# Altium schematic sheet 3V_ADC_SUPPLY.SchDoc: My title
size A3; Organization: University of California; Address1: 475 Portola Plaza; Address2: Los Angeles, CA 90095; DocumentNumber: 9; Revision: R01; SheetNumber: 9; SheetTotal: 35
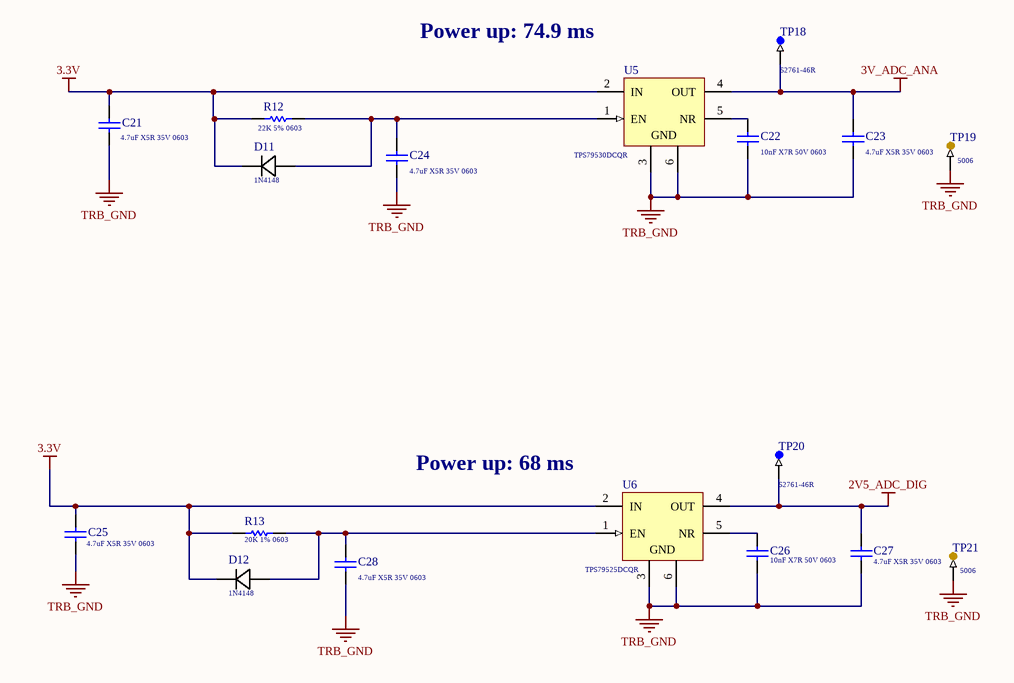
[diagram p0: 3V_ADC_SUPPLY.SchDoc]

## Parts
C21  Capacitance: 4.7uF X5R 35V 0603  [Cap_Murata_ZRB18AR6YA475ME05L_4.7uF]  (hidden comment: Cap_Murata_ZRB18AR6YA475ME05L_4.7uF)
C22  Capacitance: 10nF X7R 50V 0603  [Kemet_C0603_0]  (hidden comment: Cap_Kemet_C0603C103J5RACTU_eec)
C23  Capacitance: 4.7uF X5R 35V 0603  [Cap_Murata_ZRB18AR6YA475ME05L_4.7uF]  (hidden comment: Cap_Murata_ZRB18AR6YA475ME05L_4.7uF)
C24  Capacitance: 4.7uF X5R 35V 0603  [Cap_Murata_ZRB18AR6YA475ME05L_4.7uF]  (hidden comment: Cap_Murata_ZRB18AR6YA475ME05L_4.7uF)
C25  Capacitance: 4.7uF X5R 35V 0603  [Cap_Murata_ZRB18AR6YA475ME05L_4.7uF]  (hidden comment: Cap_Murata_ZRB18AR6YA475ME05L_4.7uF)
C26  Capacitance: 10nF X7R 50V 0603  [Kemet_C0603_0]  (hidden comment: Cap_Kemet_C0603C103J5RACTU_eec)
C27  Capacitance: 4.7uF X5R 35V 0603  [Cap_Murata_ZRB18AR6YA475ME05L_4.7uF]  (hidden comment: Cap_Murata_ZRB18AR6YA475ME05L_4.7uF)
C28  Capacitance: 4.7uF X5R 35V 0603  [Cap_Murata_ZRB18AR6YA475ME05L_4.7uF]  (hidden comment: Cap_Murata_ZRB18AR6YA475ME05L_4.7uF)
D11  Series: 1N4148  [Diode_ON_Semiconductor_1N4148WT_300mA]  (hidden comment: Diode_ON_Semiconductor_1N4148WT_300mA)
D12  Series: 1N4148  [Diode_ON_Semiconductor_1N4148WT_300mA]  (hidden comment: Diode_ON_Semiconductor_1N4148WT_300mA)
R12  22K 5% 0603  [RESC0603(1608)_L]
R13  20K 1% 0603  [RESC0603(1608)_L]
TP18  Series: S2761-46R  [TP_Harwin_S2761_46R]  (hidden comment: TP_Harwin_S2761_46R)
TP19  Series: 5006  [TP_Keystone_Electronics_5006]  (hidden comment: TP_Keystone_Electronics_5006)
TP20  Series: S2761-46R  [TP_Harwin_S2761_46R]  (hidden comment: TP_Harwin_S2761_46R)
TP21  Series: 5006  [TP_Keystone_Electronics_5006]  (hidden comment: TP_Keystone_Electronics_5006)
U5  TPS79530DCQR  [TI-DCQ6_N]
U6  TPS79525DCQR  [DCQ0006A_N]

## Nets
2V5_ADC_DIG: C27.2 TP20.1 U6.4(OUT)
3.3V: C21.2 C25.2 D11.1 D12.1 R12.1 R13.2 U5.2(IN) U6.2(IN)
3V_ADC_ANA: C23.2 TP18.1 U5.4(OUT)
TRB_GND: C21.1 C22.2 C23.1 C24.1 C25.1 C26.2 C27.1 C28.1 TP19.1 TP21.1 U5.3(GND) U5.6(GND) U6.3(GND) U6.6(GND)
NetC22_1: C22.1 U5.5(NR)
NetC24_2: C24.2 D11.2 R12.2 U5.1(EN)
NetC26_1: C26.1 U6.5(NR)
NetC28_2: C28.2 D12.2 R13.1 U6.1(EN)

## Notes on the sheet
- (near U5) Power up: 74.9 ms
- (near U6) Power up: 68 ms
- 475 Portola Plaza
- GAPS TOF
- igarcia91@g.ucla.edu
- Los Angeles, CA
- 310-825-0344
- Size:
- Date:
- Letter
- Revision:
- Time:
- Sheet
- of
- andrew.peck@cern.ch
- spq@ucla.edu
- File:

## Library data of the parts
C21 C23-C25 C27 C28 = Cap_Murata_ZRB18AR6YA475ME05L_4.7uF: CAP CER 4.7uF 35V X5R 0603; Supplier 1: Mouser; Supplier Part Number 1: 81-ZRB18AR6YA475ME5L
C22 C26 = Cap_Kemet_C0603C103J5RACTU_eec: CAP CER 10nF 50V X7R 0603; Manufacturer: Kemet; Mfg Package Ident: C0603; Part Number: C0603C103J5RACTU; helpURL: https://upverter.com/upn/revision/8a8d0c297e33ac74/; ComponentLink2Description: Datasheet; Temperature: -55°C to +125°C; Package: C0603; Supplier 2: Mouser; Price: 0.0184203126773; Supplier 1: Digi-Key; ComponentLink1URL: https://upverter.com/upn/revision/8a8d0c297e33ac74/; Supplier Part Number 2: 80-C0603C103J5R; Supplier Part Number 1: 399-1092-1-ND; Value: 10nF; ComponentLink1Description: Upverter; ComponentLink2URL: https://content.kemet.com/datasheets/KEM_C1002_X7R_SMD.pdf; RoHS: TRUE; Mouser Part Number: 80-C0603C103J5R; Temperature Range High: +125°C; Digikey Description: CAP CER 10000PF 50V X7R 0603; Digikey Part Number: 399-1092-1-ND; Lead Free: yes; Temperature Range Low: -55°C; Voltage: 50V
D11 D12 = Diode_ON_Semiconductor_1N4148WT_300mA: Diodes - General Purpose, Power, Switching SINGLE JUNC. 75V 4.0NS COMP; Supplier 1: Mouser; Supplier Part Number 1: 512-1N4148WT
R12 = CMP-1012-00106-1: 22K 0.1W 5% 0603 (1608 Metric)  SMD; Case-Metric: 1608; Value: 22000.00 Ohm; Case-EIA: 0603; Power: 0.1 W; Tolerance: 5 %; Technology: SMT
R13 = CMP-1012-00655-1: 20K 0.1W 1% 0603 (1608 Metric)  SMD; Case-Metric: 1608; Case-EIA: 0603; Value: 20000.00 Ohm; Technology: SMT; Tolerance: 1 %; Power: 0.1 W
TP18 TP20 = TP_Harwin_S2761_46R: Circuit Board Hardware - PCB SMT Mini Test Terminal, Reel; Supplier 1: Newark; Supplier Part Number 1: 76Y5391
TP19 TP21 = TP_Keystone_Electronics_5006: Circuit Board Hardware - PCB TEST POINT BLK .063; Supplier 1: Mouser; Supplier Part Number 1: 534-5006
U5 = TPS79530DCQR: Single Output High PSRR LDO, 500 mA, Fixed 3 V Output, 2.7 to 5.5 V Input, 6-pin SOT-223 (DCQ), -40 to 125 degC, Green (RoHS & no Sb/Br); Manufacturer: Texas Instruments; Accuracy(%): 2; Iq(Typ)(mA): 0.26; Vin(Min)(V): 2.7; Vout Adj(Min)(V): 3; SubFamily: Single Channel LDO; Vin(Max)(V): 5.5; Rating: Catalog; Iout(Max)(A): 0.5; Vdo(Typ)(mV): 110; Eco-Plan: Green (RoHS & no Sb/Br); PartNumber: TPS79530DCQR; ComponentLink1Description: Manufacturer URL; ComponentLink2Description: Datasheet; DatasheetVersion: SLVS350H; ComponentLink3URL: http://www.ti.com/litv/pdf/mpds098c; Vout Adj(Max)(V): 3; ComponentLink1URL: http://www.ti.com/; Fixed Output Options(V): 3; ComponentLink2URL: http://www.ti.com/general/docs/lit/getliterature.tsp?genericPartNumber=TPS79530&fileType=pdf; ComponentLink3Description: Package Specification; PackageVersion: 4202109/D; Mounting Technology: Surface Mount; PackageReference: DCQ6; PackageDescription: 6-Pin Plastic Small Outline, Body 3.5 x 6.5 mm, Pitch 1.27 mm; Supplier 1: Mouser; Supplier Part Number 1: 595-TPS79530DCQR
U6 = TPS79525DCQR: Single Output High PSRR LDO, 500 mA, Fixed 2.5 V Output, 2.7 to 5.5 V Input, 6-pin SOT-223 (DCQ), -40 to 125 degC, Green (RoHS & no Sb/Br); Manufacturer: Texas Instruments; Accuracy(%): 2; Iq(Typ)(mA): 0.26; Vin(Min)(V): 2.7; Vout Adj(Min)(V): 2.5; SubFamily: Single Channel LDO; Vin(Max)(V): 5.5; Rating: Catalog; Iout(Max)(A): 0.5; Vdo(Typ)(mV): 110; Eco-Plan: Green (RoHS & no Sb/Br); PartNumber: TPS79525DCQR; ComponentLink1Description: Manufacturer URL; ComponentLink2Description: Datasheet; DatasheetVersion: SLVS350H; ComponentLink3URL: http://www.ti.com/litv/pdf/mpds098c; Vout Adj(Max)(V): 2.5; ComponentLink1URL: http://www.ti.com/; Fixed Output Options(V): 2.5; ComponentLink2URL: http://www.ti.com/general/docs/lit/getliterature.tsp?genericPartNumber=TPS79525&fileType=pdf; PackageReference: DCQ0006A; ComponentLink3Description: Package Specification; PackageVersion: 4202109/D; Mounting Technology: Surface Mount; PackageDescription: 6-Pin Plastic Small Outline, Body 3.5 x 6.5 mm, Pitch 1.27 mm; Supplier 1: Mouser; Supplier 2: Digi-Key; Supplier 3: Arrow; Supplier Part Number 3: TPS79525DCQR; Supplier Part Number 2: 296-41778-6-ND; Supplier Part Number 1: 595-TPS79525DCQR